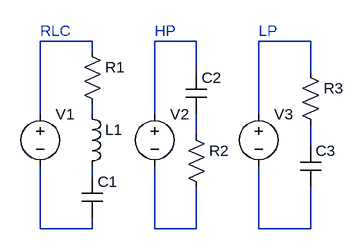
[diagram p0: schematic Draft1.asc]
Draft1.asc, the LTspice schematic file:
Version 4
SHEET 1 880 680
WIRE -96 -16 -176 -16
WIRE 64 -16 0 -16
WIRE 240 -16 160 -16
WIRE -96 0 -96 -16
WIRE 64 32 64 -16
WIRE 240 32 240 -16
WIRE -176 96 -176 -16
WIRE -96 96 -96 80
WIRE 0 96 0 -16
WIRE 160 96 160 -16
WIRE 64 128 64 96
WIRE 240 144 240 112
WIRE -96 192 -96 176
WIRE -176 272 -176 176
WIRE -96 272 -96 256
WIRE -96 272 -176 272
WIRE 0 272 0 176
WIRE 64 272 64 208
WIRE 64 272 0 272
WIRE 160 272 160 176
WIRE 240 272 240 208
WIRE 240 272 160 272
SYMBOL res -112 -16 R0
SYMATTR InstName R1
SYMATTR Value ""
SYMBOL ind -112 80 R0
SYMATTR InstName L1
SYMATTR Value ""
SYMBOL cap -112 256 M180
WINDOW 0 24 56 Left 2
WINDOW 3 24 8 Left 2
SYMATTR InstName C1
SYMATTR Value ""
SYMBOL cap 48 32 R0
SYMATTR InstName C2
SYMATTR Value ""
SYMBOL res 48 112 R0
SYMATTR InstName R2
SYMATTR Value ""
SYMBOL res 224 16 R0
SYMATTR InstName R3
SYMATTR Value ""
SYMBOL cap 224 144 R0
SYMATTR InstName C3
SYMATTR Value ""
SYMBOL voltage -176 80 R0
SYMATTR InstName V1
SYMATTR Value ""
SYMBOL voltage 0 80 R0
SYMATTR InstName V2
SYMATTR Value ""
SYMBOL voltage 160 80 R0
SYMATTR InstName V3
SYMATTR Value ""
TEXT -176 -32 Left 2 ;RLC
TEXT 0 -32 Left 2 ;HP
TEXT 160 -32 Left 2 ;LP

The netlist it stands for:
* Draft1.asc
R1 N001 N004
L1 N004 N007
C1 N008 N007
C2 N002 N005
R2 N005 N009
R3 N003 N006
C3 N006 N010
V1 N001 N008
V2 N002 N009
V3 N003 N010
* RLC
* HP
* LP
.backanno
.end